# Altium schematic sheet EEPROM.SchDoc: foxBMS BMS-Master
size A3; DocumentNumber: 20; SheetNumber: 20; SheetTotal: 24; Author: Fraunhofer IISB foxBMS Team; REL-DATE: 2017-05-16; VERSION: 1.0.2; SheetDescription: EEPROM
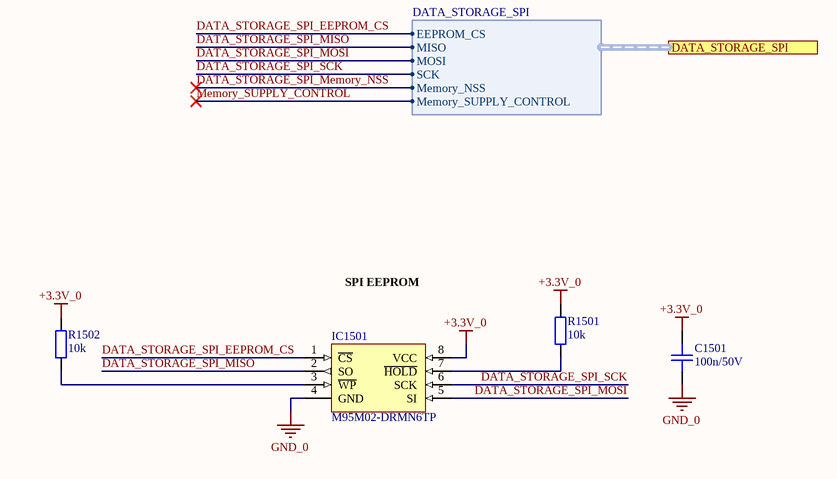
[diagram p0: EEPROM.SchDoc]

## Parts
C1501  100n/50V  [CAPC1608X08N]
IC1501  M95M02-DRMN6TP  [SOIC127P600X175-8N]
R1501  10k  [RESC1608X05N]
R1502  10k  [RESC1608X05N]

## Ports
DATA_STORAGE_SPI (harness DATA_STORAGE_SPI)

## Harnesses
DATA_STORAGE_SPI: EEPROM_CS, MISO, MOSI, SCK, Memory_NSS, Memory_SUPPLY_CONTROL

## Nets
+3.3V_0: C1501.2 IC1501.8(VCC) R1501.2 R1502.2
GND_0: C1501.1 IC1501.4(GND)
DATA_STORAGE_SPI_EEPROM_CS: IC1501.1(~{CS}) ; port DATA_STORAGE_SPI.EEPROM_CS
DATA_STORAGE_SPI_Memory_NSS: port DATA_STORAGE_SPI.Memory_NSS
DATA_STORAGE_SPI_MISO: IC1501.2(SO) ; port DATA_STORAGE_SPI.MISO
DATA_STORAGE_SPI_MOSI: IC1501.5(SI) ; port DATA_STORAGE_SPI.MOSI
DATA_STORAGE_SPI_SCK: IC1501.6(SCK) ; port DATA_STORAGE_SPI.SCK
Memory_SUPPLY_CONTROL: port DATA_STORAGE_SPI.Memory_SUPPLY_CONTROL
NetIC1501_3: IC1501.3(~{WP}) R1502.1
NetIC1501_7: IC1501.7(~{HOLD}) R1501.1

## Notes on the sheet
- SPI EEPROM
- Fraunhofer IISB
- Schottkystr. 10
- developed by:
- 91058 Erlangen
- Germany
- Author
- Project
- License
- Description
- File
- Version
- Release Date
- Sheet
- www.foxbms.org
- www.iisb.fraunhofer.de
- foxBMS Team
- /

## Library data of the parts
C1501 = gen_C_ceramic_100n_50V_X7R_0603: MLCC; Capacitance: 100n; Rated Voltage: 50V; Dielectric: X7R; Case EIA: 0603; Case Metric: 1608; PnP Package: C_0603_10; PnP Value: 100n/50V/X7R; PnP equipped: x; Automotive Qualified: False; Part Number: gen_C_ceramic_100n_50V_X7R_0603; Supplier 1: Farnell; Supplier Part Number 1: 2525267; Supplier 2: Digikey; Supplier Part Number 2: 490-6049-1-ND
IC1501 = M95M02-DRMN6TP: 2-Mbit serial SPI bus EEPROM; Manufacturer: StMicroelectronics; PnP Package: SOIC-8; Automotive Qualified: False; Part Number: M95M02-DRMN6TP; Part Name: M95M02-DRMN6TP; Operating Temperature: -40°C - +85°C; ComponentLink1Description: Datasheet; ComponentLink1URL: http://www.st.com/resource/en/datasheet/m95m02-dr.pdf; Supplier 1: Farnell; Supplier Part Number 1: 2849991; Supplier 2: Digikey; Supplier Part Number 2: 497-11405-1-ND
R1501 R1502 = gen_R_10k_0603: SMD Resistor 10k 0603; Tolerance: 1%; Power: 0.1W; Case EIA: 0603; Case Metric: 1608; Maximum Working Voltage: 75V; PnP Package: R_0603; Automotive Qualified: False; Part Number: gen_R_10k_0603; Operating Temperature: -55°C - +155°C; Resistance: 10k; Series: E24, E96; PnP Value: 10k; Supplier 1: Farnell; Supplier Part Number 1: 2073349